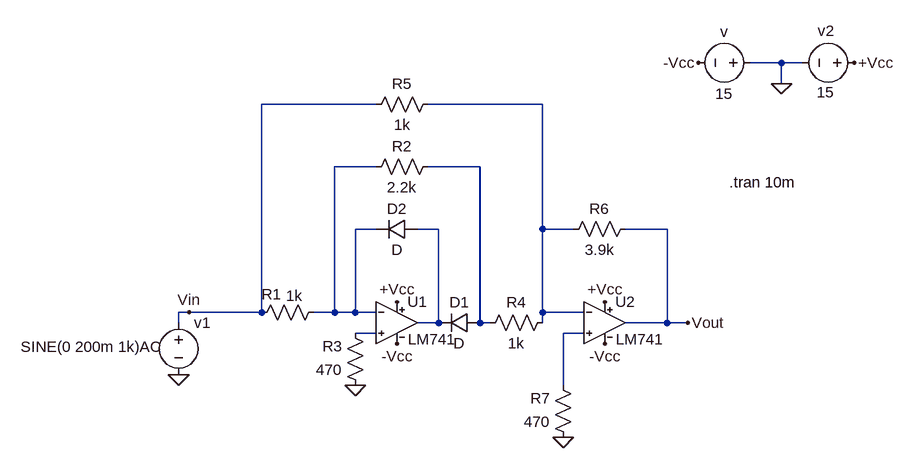
[diagram p0: schematic Full wave.asc]
Full wave.asc, the LTspice schematic file:
Version 4
SHEET 1 924 680
WIRE 736 -240 688 -240
WIRE 768 -240 736 -240
WIRE 736 -208 736 -240
WIRE 112 -176 -64 -176
WIRE 368 -176 192 -176
WIRE 112 -80 48 -80
WIRE 272 -80 192 -80
WIRE 112 16 80 16
WIRE 208 16 176 16
WIRE 368 16 368 -176
WIRE 416 16 368 16
WIRE 560 16 496 16
WIRE -176 144 -192 144
WIRE -64 144 -64 -176
WIRE -64 144 -176 144
WIRE 48 144 48 -80
WIRE 48 144 16 144
WIRE 80 144 80 16
WIRE 80 144 48 144
WIRE 112 144 80 144
WIRE 368 144 368 16
WIRE 432 144 368 144
WIRE -192 160 -192 144
WIRE 208 160 208 16
WIRE 208 160 176 160
WIRE 272 160 272 -80
WIRE 272 160 256 160
WIRE 288 160 272 160
WIRE 368 160 368 144
WIRE 560 160 560 16
WIRE 560 160 496 160
WIRE 592 160 560 160
WIRE 112 176 80 176
WIRE 432 176 400 176
WIRE 400 256 400 176
FLAG 144 128 +Vcc
FLAG 144 192 -Vcc
FLAG 608 -240 -Vcc
FLAG 848 -240 +Vcc
FLAG -192 240 0
FLAG 464 192 -Vcc
FLAG 464 128 +Vcc
FLAG 400 336 0
FLAG 592 160 Vout
FLAG -176 144 Vin
FLAG 736 -208 0
FLAG 80 256 0
SYMBOL voltage 704 -240 R90
WINDOW 0 -32 56 VBottom 2
WINDOW 3 32 56 VTop 2
SYMATTR InstName v
SYMATTR Value 15
SYMBOL voltage 864 -240 R90
WINDOW 0 -49 72 VLeft 2
WINDOW 3 45 47 VRight 2
WINDOW 123 0 0 Left 2
WINDOW 39 0 0 Left 2
SYMATTR InstName v2
SYMATTR Value 15
SYMBOL LM741 144 96 R0
SYMATTR InstName U1
SYMBOL diode 176 0 R90
WINDOW 0 0 32 VBottom 2
WINDOW 3 32 32 VTop 2
SYMATTR InstName D2
SYMBOL diode 272 144 R90
WINDOW 0 0 32 VBottom 2
WINDOW 3 32 32 VTop 2
SYMATTR InstName D1
SYMBOL res 208 -96 R90
WINDOW 0 0 56 VBottom 2
WINDOW 3 32 56 VTop 2
SYMATTR InstName R2
SYMATTR Value 2.2k
SYMBOL res 384 144 R90
WINDOW 0 0 56 VBottom 2
WINDOW 3 32 56 VTop 2
SYMATTR InstName R4
SYMATTR Value 1k
SYMBOL res 32 128 R90
WINDOW 0 4 81 VBottom 2
WINDOW 3 -25 46 VTop 2
SYMATTR InstName R1
SYMATTR Value 1k
SYMBOL res 208 -192 R90
WINDOW 0 0 56 VBottom 2
WINDOW 3 32 56 VTop 2
SYMATTR InstName R5
SYMATTR Value 1k
SYMBOL LM741 464 96 R0
SYMATTR InstName U2
SYMBOL voltage -192 144 R0
WINDOW 123 0 0 Left 2
WINDOW 39 0 0 Left 2
WINDOW 3 -243 53 Left 2
SYMATTR Value SINE(0 200m 1k)AC
SYMATTR InstName v1
SYMBOL res 512 0 R90
WINDOW 0 0 56 VBottom 2
WINDOW 3 32 56 VTop 2
SYMATTR InstName R6
SYMATTR Value 3.9k
SYMBOL res 416 352 R180
WINDOW 0 36 76 Left 2
WINDOW 3 36 40 Left 2
SYMATTR InstName R7
SYMATTR Value 470
SYMBOL res 96 272 R180
WINDOW 0 36 76 Left 2
WINDOW 3 36 40 Left 2
SYMATTR InstName R3
SYMATTR Value 470
TEXT 656 -56 Left 2 !.tran 10m

The netlist it stands for:
* Full wave.asc
v 0 -Vcc 15
v2 +Vcc 0 15
XU1 N005 N002 +Vcc -Vcc N004 LM741  ; pins In+ In- V+ V- OUT
D2 N004 N002 D
D1 N003 N004 D
R2 N003 N002 2.2k
R4 N001 N003 1k
R1 N002 Vin 1k
R5 N001 Vin 1k
XU2 N006 N001 +Vcc -Vcc Vout LM741  ; pins In+ In- V+ V- OUT
v1 Vin 0 SINE(0 200m 1k)AC
R6 Vout N001 3.9k
R7 0 N006 470
R3 0 N005 470
.model D D
.lib standard.dio
.tran 10m
.lib LM741.lib
.backanno
.end